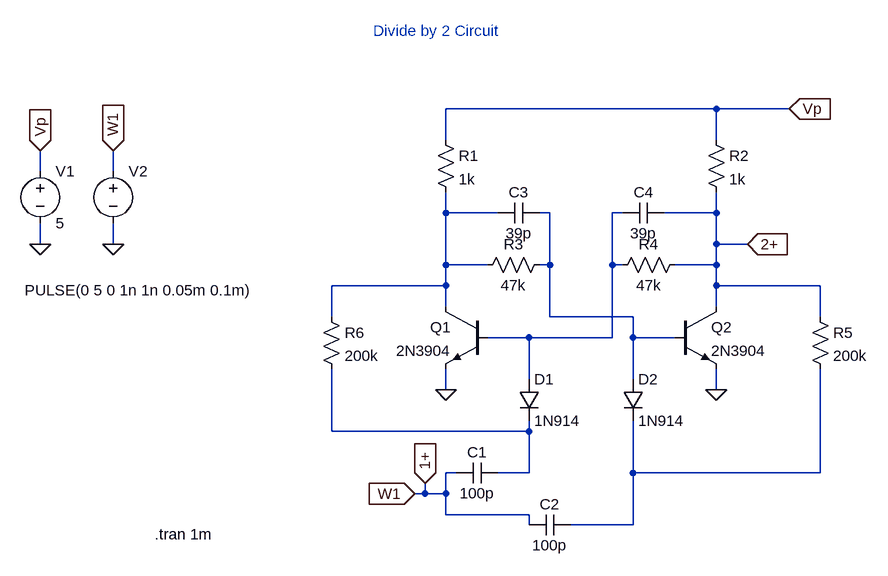
[diagram p0: schematic divide_by_two_ltspice.asc]
divide_by_two_ltspice.asc, the LTspice schematic file:
Version 4
SHEET 1 880 680
WIRE 400 -240 -16 -240
WIRE 512 -240 400 -240
WIRE -16 -192 -16 -240
WIRE 400 -192 400 -240
WIRE -640 -144 -640 -176
WIRE -528 -144 -528 -176
WIRE -16 -80 -16 -112
WIRE 64 -80 -16 -80
WIRE 144 -80 128 -80
WIRE 256 -80 240 -80
WIRE 400 -80 400 -112
WIRE 400 -80 320 -80
WIRE -640 -32 -640 -64
WIRE -528 -32 -528 -64
WIRE 400 -32 400 -80
WIRE 448 -32 400 -32
WIRE -16 0 -16 -80
WIRE 48 0 -16 0
WIRE 144 0 144 -80
WIRE 144 0 128 0
WIRE 240 0 240 -80
WIRE 256 0 240 0
WIRE 400 0 400 -32
WIRE 400 0 336 0
WIRE -16 32 -16 0
WIRE -16 32 -192 32
WIRE 400 32 400 0
WIRE 560 32 400 32
WIRE -16 64 -16 32
WIRE 400 64 400 32
WIRE -192 80 -192 32
WIRE 144 80 144 0
WIRE 272 80 144 80
WIRE 560 80 560 32
WIRE 112 112 48 112
WIRE 240 112 240 0
WIRE 240 112 112 112
WIRE 272 112 272 80
WIRE 336 112 272 112
WIRE 112 176 112 112
WIRE 272 176 272 112
WIRE -16 192 -16 160
WIRE 400 192 400 160
WIRE -192 256 -192 160
WIRE 112 256 112 240
WIRE 112 256 -192 256
WIRE 0 320 -16 320
WIRE 112 320 112 256
WIRE 112 320 64 320
WIRE 272 320 272 240
WIRE 560 320 560 160
WIRE 560 320 272 320
WIRE -48 352 -48 336
WIRE -48 352 -64 352
WIRE -16 352 -16 320
WIRE -16 352 -48 352
WIRE -16 384 -16 352
WIRE 112 384 -16 384
WIRE 112 400 112 384
WIRE 272 400 272 320
WIRE 272 400 176 400
FLAG -16 192 0
FLAG 512 -240 Vp
IOPIN 512 -240 In
FLAG 448 -32 2+
IOPIN 448 -32 In
FLAG -64 352 W1
IOPIN -64 352 In
FLAG 400 192 0
FLAG -48 336 1+
IOPIN -48 336 In
FLAG -640 -32 0
FLAG -528 -32 0
FLAG -640 -176 Vp
IOPIN -640 -176 In
FLAG -528 -176 W1
IOPIN -528 -176 In
SYMBOL npn 48 64 M0
SYMATTR InstName Q1
SYMATTR Value 2N3904
SYMBOL npn 336 64 R0
SYMATTR InstName Q2
SYMATTR Value 2N3904
SYMBOL res -32 -208 R0
SYMATTR InstName R1
SYMATTR Value 1k
SYMBOL res 384 -208 R0
SYMATTR InstName R2
SYMATTR Value 1k
SYMBOL res 144 -16 R90
WINDOW 0 0 56 VBottom 2
WINDOW 3 32 56 VTop 2
SYMATTR InstName R3
SYMATTR Value 47k
SYMBOL res 352 -16 R90
WINDOW 0 0 56 VBottom 2
WINDOW 3 32 56 VTop 2
SYMATTR InstName R4
SYMATTR Value 47k
SYMBOL cap 64 304 R90
WINDOW 0 0 32 VBottom 2
WINDOW 3 32 32 VTop 2
SYMATTR InstName C1
SYMATTR Value 100p
SYMBOL cap 176 384 R90
WINDOW 0 0 32 VBottom 2
WINDOW 3 32 32 VTop 2
SYMATTR InstName C2
SYMATTR Value 100p
SYMBOL cap 128 -96 R90
WINDOW 0 0 32 VBottom 2
WINDOW 3 32 32 VTop 2
SYMATTR InstName C3
SYMATTR Value 39p
SYMBOL cap 320 -96 R90
WINDOW 0 0 32 VBottom 2
WINDOW 3 32 32 VTop 2
SYMATTR InstName C4
SYMATTR Value 39p
SYMBOL diode 96 176 R0
SYMATTR InstName D1
SYMATTR Value 1N914
SYMBOL diode 256 176 R0
SYMATTR InstName D2
SYMATTR Value 1N914
SYMBOL voltage -640 -160 R0
WINDOW 123 0 0 Left 0
WINDOW 39 0 0 Left 0
SYMATTR InstName V1
SYMATTR Value 5
SYMBOL voltage -528 -160 R0
WINDOW 3 -136 199 Left 2
WINDOW 123 0 0 Left 0
WINDOW 39 0 0 Left 0
SYMATTR InstName V2
SYMATTR Value PULSE(0 5 0 1n 1n 0.05m 0.1m)
SYMBOL res 544 64 R0
SYMATTR InstName R5
SYMATTR Value 200k
SYMBOL res -208 64 R0
SYMATTR InstName R6
SYMATTR Value 200k
TEXT -464 414 Left 2 !.tran 1m
TEXT -128 -360 Left 2 ;Divide by 2 Circuit

The netlist it stands for:
* divide_by_two_ltspice.asc
Q1 N001 N003 0 0 2N3904
Q2 2+ N002 0 0 2N3904
R1 Vp N001 1k
R2 Vp 2+ 1k
R3 N002 N001 47k
R4 2+ N003 47k
C1 N004 1+ 100p
C2 N005 1+ 100p
C3 N002 N001 39p
C4 2+ N003 39p
D1 N003 N004 1N914
D2 N002 N005 1N914
V1 Vp 0 5
V2 1+ 0 PULSE(0 5 0 1n 1n 0.05m 0.1m)
R5 2+ N005 200k
R6 N001 N004 200k
.model D D
.lib standard.dio
.model NPN NPN
.model PNP PNP
.lib standard.bjt
.tran 1m
* Divide by 2 Circuit
.backanno
.end